# Altium schematic sheet US_Driver.SchDoc: 超声波驱动电源板
size A4; Author: Niu; Organization: LD; Revision: 0.5
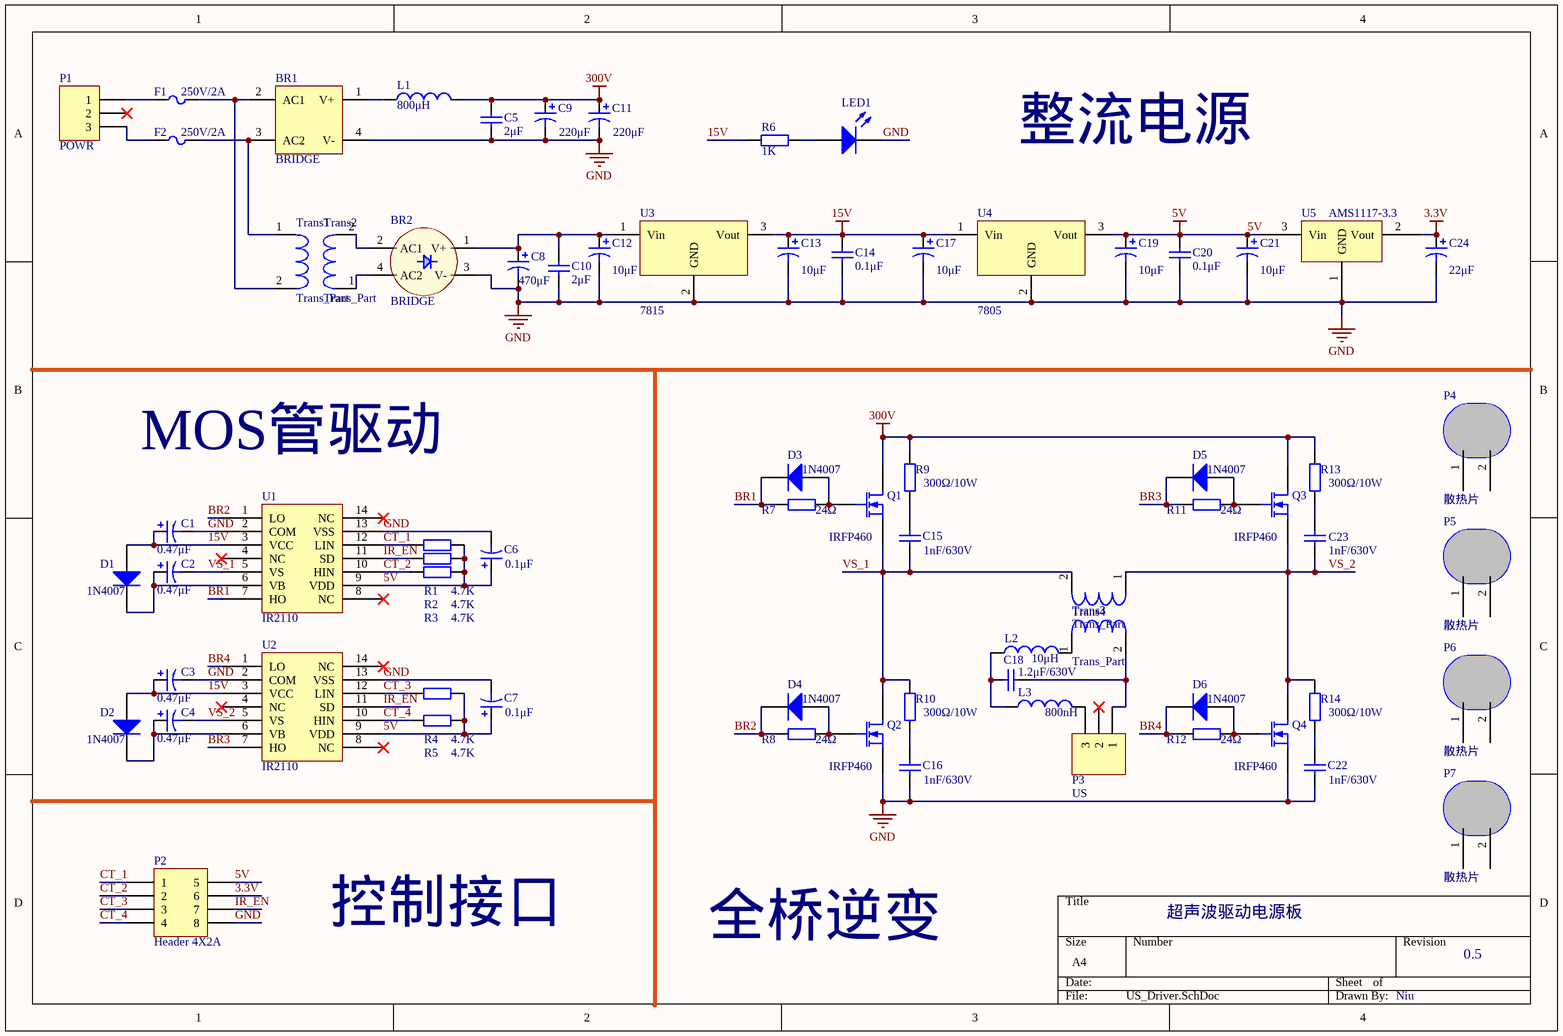
[diagram p0: US_Driver.SchDoc]

## Parts
BR1  BRIDGE  [GBU4M]
BR2  BRIDGE  [BR_CIRCLE]
C1  value 0.47μF  [Cap_4*7]  (hidden comment: Cap Pol3)
C2  value 0.47μF  [Cap_4*7]  (hidden comment: Cap Pol3)
C3  value 0.47μF  [Cap_4*7]  (hidden comment: Cap Pol3)
C4  value 0.47μF  [Cap_4*7]  (hidden comment: Cap Pol3)
C5  value 2μF  [瓷片电容]  (hidden comment: Cap Semi)
C6  value 0.1μF  [Cap_5*11]  (hidden comment: Cap Pol3)
C7  value 0.1μF  [Cap_5*11]  (hidden comment: Cap Pol3)
C8  value 470μF  [Cap_10*20]  (hidden comment: Cap Pol1)
C9  value 220μF  [Cap_450V]  (hidden comment: Cap Pol1)
C10  value 2μF  [瓷片电容]  (hidden comment: Cap Semi)
C11  value 220μF  [Cap_450V]  (hidden comment: Cap Pol1)
C12  value 10μF  [Cap_5*11]  (hidden comment: Cap Pol1)
C13  value 10μF  [Cap_5*11]  (hidden comment: Cap Pol1)
C14  value 0.1μF  [瓷片电容]  (hidden comment: Cap Semi)
C15  value 1nF/630V  [瓷片电容]  (hidden comment: Cap)
C16  value 1nF/630V  [瓷片电容]  (hidden comment: Cap)
C17  value 10μF  [Cap_5*11]  (hidden comment: Cap Pol1)
C18  value 1.2μF/630V  [Cap_15]  (hidden comment: Cap)
C19  value 10μF  [Cap_5*11]  (hidden comment: Cap Pol1)
C20  value 0.1μF  [瓷片电容]  (hidden comment: Cap Semi)
C21  value 10μF  [Cap_5*11]  (hidden comment: Cap Pol1)
C22  value 1nF/630V  [瓷片电容]  (hidden comment: Cap)
C23  value 1nF/630V  [瓷片电容]  (hidden comment: Cap)
C24  value 22μF  [Cap_5*11]  (hidden comment: Cap Pol1)
D1  1N4007  [DO-41]
D2  1N4007  [DO-41]
D3  1N4007  [DO-41]
D4  1N4007  [DO-41]
D5  1N4007  [DO-41]
D6  1N4007  [DO-41]
F1  value 250V/2A  [FUSE]  (hidden comment: Fuse)
F2  value 250V/2A  [FUSE]  (hidden comment: Fuse)
L1  value 800μH  [工字电感8*10]  (hidden comment: Inductor)
L2  value 10μH  [工字电感8*10]  (hidden comment: Inductor)
L3  value 800nH  [工字电感8*10]  (hidden comment: Inductor)
LED1  LED1  [BAT-2]  (value not drawn)
P1  POWR  [CH3.96-3P]
P2  Header 4X2A  [HDR2X4_CEN]
P3  US  [CH3.96-3P]
P4  散热片  [散热器_TO247]
P5  散热片  [散热器_TO247]
P6  散热片  [散热器_TO247]
P7  散热片  [散热器_TO247]
Q1  value IRFP460  [TO-247]  (hidden comment: MOSFET-N)
Q2  value IRFP460  [TO-247]  (hidden comment: MOSFET-N)
Q3  value IRFP460  [TO-247]  (hidden comment: MOSFET-N)
Q4  value IRFP460  [TO-247]  (hidden comment: MOSFET-N)
R1  value 4.7K  [AXIAL-0.4]  (hidden comment: Res2)
R2  value 4.7K  [AXIAL-0.4]  (hidden comment: Res2)
R3  value 4.7K  [AXIAL-0.4]  (hidden comment: Res2)
R4  value 4.7K  [AXIAL-0.4]  (hidden comment: Res2)
R5  value 4.7K  [AXIAL-0.4]  (hidden comment: Res2)
R6  value 1K  [AXIAL-0.4]  (hidden comment: Res2)
R7  value 24Ω  [AXIAL-0.4]  (hidden comment: Res2)
R8  value 24Ω  [AXIAL-0.4]  (hidden comment: Res2)
R9  value 300Ω/10W  [Res_10W_立式]  (hidden comment: Res2)
R10  value 300Ω/10W  [Res_10W_立式]  (hidden comment: Res2)
R11  value 24Ω  [AXIAL-0.4]  (hidden comment: Res2)
R12  value 24Ω  [AXIAL-0.4]  (hidden comment: Res2)
R13  value 300Ω/10W  [Res_10W_立式]  (hidden comment: Res2)
R14  value 300Ω/10W  [Res_10W_立式]  (hidden comment: Res2)
Trans1  Trans_Part  [Trans_Part]
Trans2  Trans_Part  [Trans_Part]
Trans3  Trans_Part  [Trans_Part]
Trans4  Trans_Part  [Trans_Part]
U1  IR2110  [DIP-14]
U2  IR2110  [DIP-14]
U3  7815  [TO-220AB]
U4  7805  [TO-220AB]
U5  AMS1117-3.3  [TO-220AB]

## Nets
3.3V: C24.1 P2.6 U5.2(Vout)
5V: C6.1 C7.1 C19.1 C20.2 C21.1 P2.5 R1.2 R2.2 R3.2 R4.2 R5.2 U1.9(VDD) U2.9(VDD) U4.3(Vout) U5.3(Vin)
15V: C1.1 C3.1 C13.1 C14.2 C17.1 D1.1(A) D2.1(A) R6.2 U1.3(VCC) U2.3(VCC) U3.3(Vout) U4.1(Vin)
300V: C5.2 C9.1 C11.1 L1.2 Q1.1(D) Q3.1(D) R9.2 R13.2
GND: BR1.4(V-) BR2.3(V-) C1.2 C3.2 C5.1 C6.2 C7.2 C8.2 C9.2 C10.1 C11.2 C12.2 C13.2 C14.1 C16.1 C17.2 C19.2 C20.1 C21.2 C22.1 C24.2 LED1.2(K) P2.8 Q2.3(S) Q4.3(S) U1.2(COM) U1.13(VSS) U2.2(COM) U2.13(VSS) U3.2(GND) U4.2(GND) U5.1(GND)
BR1: D3.2(K) R7.1 U1.7(HO)
BR2: D4.2(K) R8.1 U1.1(LO)
BR3: D5.2(K) R11.1 U2.7(HO)
BR4: D6.2(K) R12.1 U2.1(LO)
CT_1: P2.1 R1.1 U1.12(LIN)
CT_2: P2.2 R3.1 U1.10(HIN)
CT_3: P2.3 R4.1 U2.12(LIN)
CT_4: P2.4 R5.1 U2.10(HIN)
IR_EN: P2.7 R2.1 U1.11(SD) U2.11(SD)
VS_1: C2.2 C15.1 Q1.3(S) Q2.1(D) R10.2 Trans3.2 U1.5(VS)
VS_2: C4.2 C23.1 Q3.3(S) Q4.1(D) R14.2 Trans3.1 U2.5(VS)
NetBR1_1: BR1.1(V+) L1.1
NetBR1_2: BR1.2(AC1) F1.2 Trans1.2
NetBR1_3: BR1.3(AC2) F2.2 Trans1.1
NetBR2_1: BR2.1(V+) C8.1 C10.2 C12.1 U3.1(Vin)
NetBR2_2: BR2.2(AC1) Trans2.2
NetBR2_4: BR2.4(AC2) Trans2.1
NetC2_1: C2.1 D1.2(K) U1.6(VB)
NetC4_1: C4.1 D2.2(K) U2.6(VB)
NetC15_2: C15.2 R9.1
NetC16_2: C16.2 R10.1
NetC18_1: C18.1 P3.1 Trans4.2
NetC18_2: C18.2 L2.1 L3.1
NetC22_2: C22.2 R14.1
NetC23_2: C23.2 R13.1
NetD3_1: D3.1(A) Q1.2(G) R7.2
NetD4_1: D4.1(A) Q2.2(G) R8.2
NetD5_1: D5.1(A) Q3.2(G) R11.2
NetD6_1: D6.1(A) Q4.2(G) R12.2
NetF1_1: F1.1 P1.1
NetF2_1: F2.1 P1.3
NetL2_2: L2.2 Trans4.1
NetL3_2: L3.2 P3.3
NetLED1_1: LED1.1(A) R6.1

Not connected (* = marked no-connect by the designer): P1 2*; P3 2*; P4 1 2; P5 1 2; P6 1 2; P7 1 2; U1 4(NC)* 8(NC)* 14(NC)*; U2 4(NC)* 8(NC)* 14(NC)*

## Notes on the sheet
- 整流电源
- MOS管驱动
- 控制接口
- 全桥逆变

## Library data of the parts
BR1 = BRIDGE: BR
BR2 = BRIDGE_Circle: BR
C1-C4 C6 C7 = Cap Pol3: Polarized Capacitor (Surface Mount); Published: 8-Jun-2000; LatestRevisionDate: 29-May-2009; LatestRevisionNote: IPC-7351 Footprint Added.; PackageReference: C0805; Publisher: Altium Limited; PackageDescription: Chip Capacitor
C5 C10 C14 C20 = Cap Semi: Capacitor (Semiconductor SIM Model); Published: 8-Jun-2000; LatestRevisionDate: 29-May-2009; LatestRevisionNote: IPC-7351 Footprint Added.; PackageReference: C1206; Publisher: Altium Limited; PackageDescription: Chip Capacitor
C8 C9 C11-C13 C17 C19 C21 C24 = Cap Pol1: Polarized Capacitor (Radial); Published: 8-Jun-2000; LatestRevisionDate: 17-Jul-2002; LatestRevisionNote: Re-released for DXP Platform.; PackageReference: RB7.6-15; Publisher: Altium Limited; PackageDescription: Polarized Capacitor (Radial); 2 Leads
C15 C16 C18 C22 C23 = Cap: Capacitor; Published: 8-Jun-2000; LatestRevisionDate: 17-Jul-2002; LatestRevisionNote: Re-released for DXP Platform.; PackageReference: RAD-0.3; Publisher: Altium Limited; PackageDescription: Radial Cap, Thru-Hole; 2 Leads; 0.3 in Pin Spacing
D1-D6 = Diode 1N4007: 1 Amp General Purpose Rectifier; Published: 8-Jun-2000; LatestRevisionDate: 17-Jul-2002; LatestRevisionNote: Re-released for DXP Platform.; DatasheetVersion: 1998; PackageVersion: Aug-1999; PackageReference: DO-41; Publisher: Altium Limited; PackageDescription: Diode, Axial; Body 5.2 x 2.7 mm (LxDia. max), Lead Dia. 0.86 mm (max); Code_JEDEC: DO-204-AL; ComponentLink1Description: Manufacturer Link; ComponentLink1URL: http://www.fairchildsemi.com/; ComponentLink2Description: Datasheet; ComponentLink2URL: http://www.fairchildsemi.com/ds/1N%2F1N4001.pdf
L1-L3 = Inductor: Code_IEC: 1005; Published: 8-Jun-2000; LatestRevisionDate: 29-May-2009; LatestRevisionNote: IPC-7351 Footprint Added.; PackageReference: 0402-A; Publisher: Altium Limited; PackageDescription: Chip Inductor; Code_JEITA: 0402
LED1 = LED1: Typical RED GaAs LED; Published: 8-Jun-2000; LatestRevisionDate: 08-Jul-2005; LatestRevisionNote: Mech Layer 1 removed.; PackageReference: LED-1; Publisher: Altium Limited; PackageDescription: LED; 2 Leads
P1 P3 = Header 3: Header, 3-Pin; LatestRevisionDate: 17-Jul-2002; LatestRevisionNote: Re-released for DXP Platform.; Publisher: Altium Limited
P2 = Header 4X2A: Header, 4-Pin, Dual row; LatestRevisionDate: 17-Jul-2002; LatestRevisionNote: Re-released for DXP Platform.; Publisher: Altium Limited
Q1-Q4 = MOSFET-N: N-Channel MOSFET; Published: 8-Jun-2000; LatestRevisionDate: 17-Jul-2002; LatestRevisionNote: Re-released for DXP Platform.; PackageVersion: 1995/1996; PackageReference: E3; Publisher: Altium Limited; PackageDescription: TO, Flat Index; 3 In-Line, Axial Leads; Body Dia. 4.6mm; Lead Dia. 0.5 mm (max)
R1-R14 = Res2: Resistor; Published: 8-Jun-2000; LatestRevisionDate: 17-Jul-2002; LatestRevisionNote: Re-released for DXP Platform.; PackageReference: AXIAL-0.4; Publisher: Altium Limited; PackageDescription: Axial Device, Thru-Hole; 2 Leads; 0.4 in Pin Spacing
U3 = 7805
F1 F2 = Fuse: Published: 8-Jun-2000; LatestRevisionDate: 17-Jul-2002; LatestRevisionNote: Re-released for DXP Platform.; PackageReference: PIN-W2/E2.8; Publisher: Altium Limited